# EAGLE design BUZZI-27 (EAGLE 4.15)
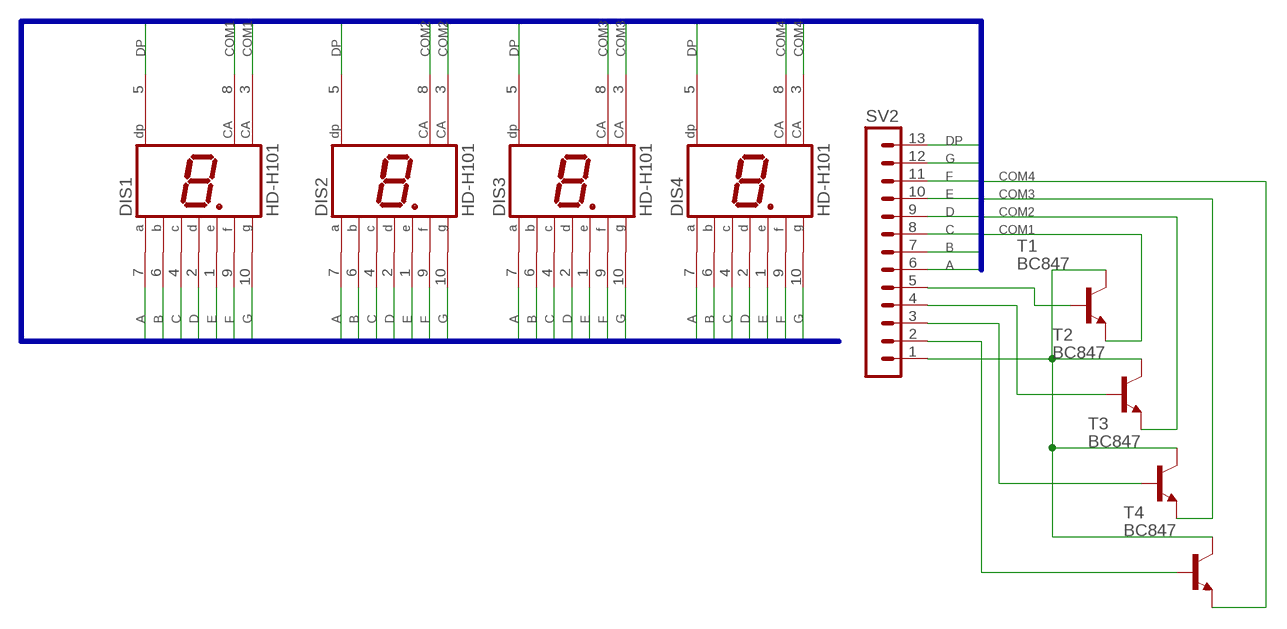
[diagram p0: schematic, sheet 1]

## Parts
DIS1  HD-H101  [HDSP-M]
DIS2  HD-H101  [HDSP-M]
DIS3  HD-H101  [HDSP-M]
DIS4  HD-H101  [HDSP-M]
SV2  MA13-1  [MA13-1]
T1  BC847  [SOT23]
T2  BC847  [SOT23]
T3  BC847  [SOT23]
T4  BC847  [SOT23]

## Nets
A: DIS1.7(A) DIS2.7(A) DIS3.7(A) DIS4.7(A) SV2.6
B: DIS1.6(B) DIS2.6(B) DIS3.6(B) DIS4.6(B) SV2.7
C: DIS1.4(C) DIS2.4(C) DIS3.4(C) DIS4.4(C) SV2.8
COM1: DIS1.3(CA) DIS1.8(CA) T1.2(E)
COM2: DIS2.3(CA) DIS2.8(CA) T2.2(E)
COM3: DIS3.3(CA) DIS3.8(CA) T3.2(E)
COM4: DIS4.3(CA) DIS4.8(CA) T4.2(E)
D: DIS1.2(D) DIS2.2(D) DIS3.2(D) DIS4.2(D) SV2.9
DP: DIS1.5(DP) DIS2.5(DP) DIS3.5(DP) DIS4.5(DP) SV2.13
E: DIS1.1(E) DIS2.1(E) DIS3.1(E) DIS4.1(E) SV2.10
F: DIS1.9(F) DIS2.9(F) DIS3.9(F) DIS4.9(F) SV2.11
G: DIS1.10(G) DIS2.10(G) DIS3.10(G) DIS4.10(G) SV2.12
N$1: SV2.5 T1.1(B)
N$2: SV2.4 T2.1(B)
N$3: SV2.3 T3.1(B)
N$4: SV2.2 T4.1(B)
N$5: SV2.1 T1.3(C) T2.3(C) T3.3(C) T4.3(C)

## Buses
DATA:A,B,C,D,E,F,G,DP,COM1,COM2,COM3,COM4

## Library data of the parts
DIS1-DIS4 = display-hp:HD-H101: LED DISPLAY 1-character 7 segment, decimal point right
SV2 = con-lstb:MA13-1: PIN HEADER
T1-T4 = transistor:BC847: NPN TRANSISTOR

## Board
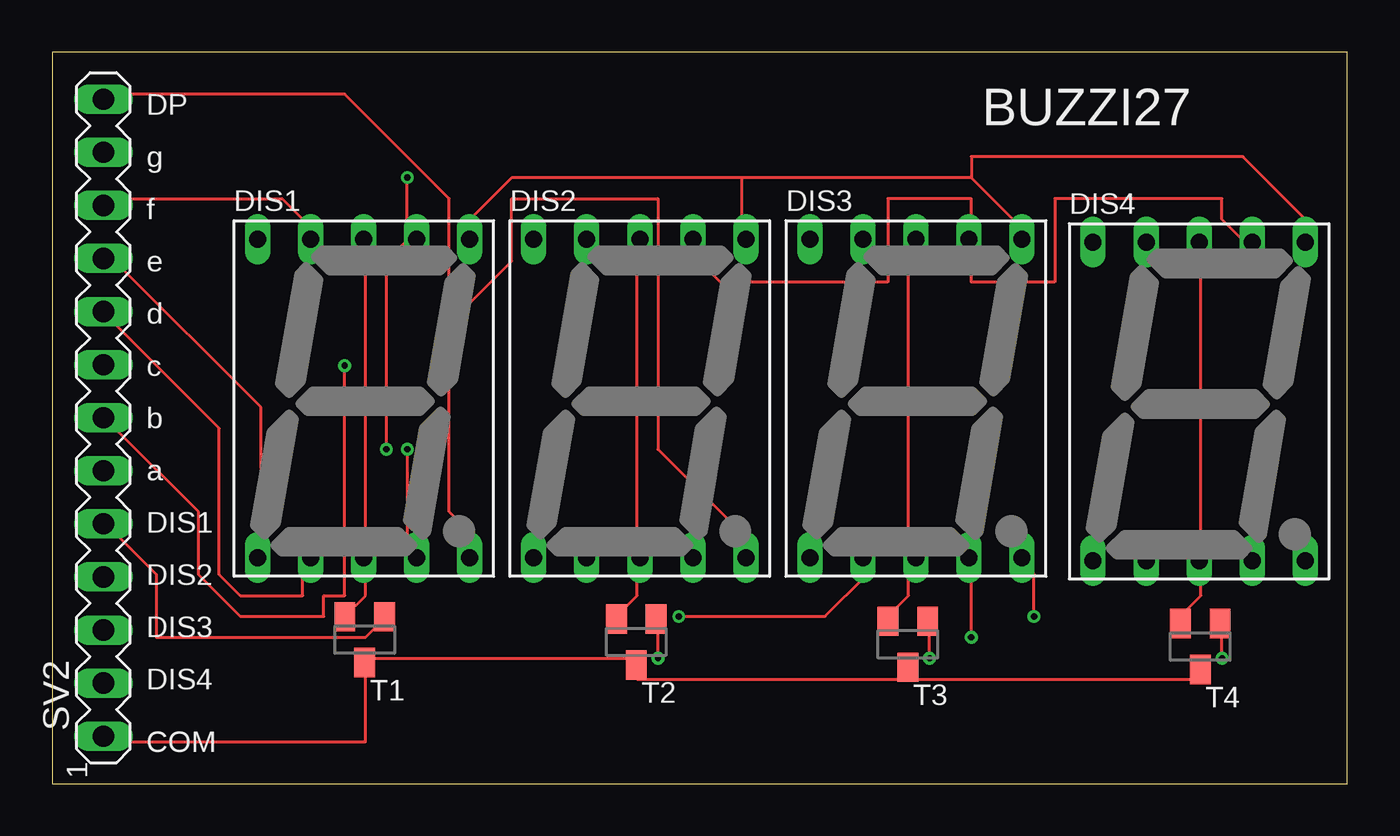
[diagram p1: board, top side]
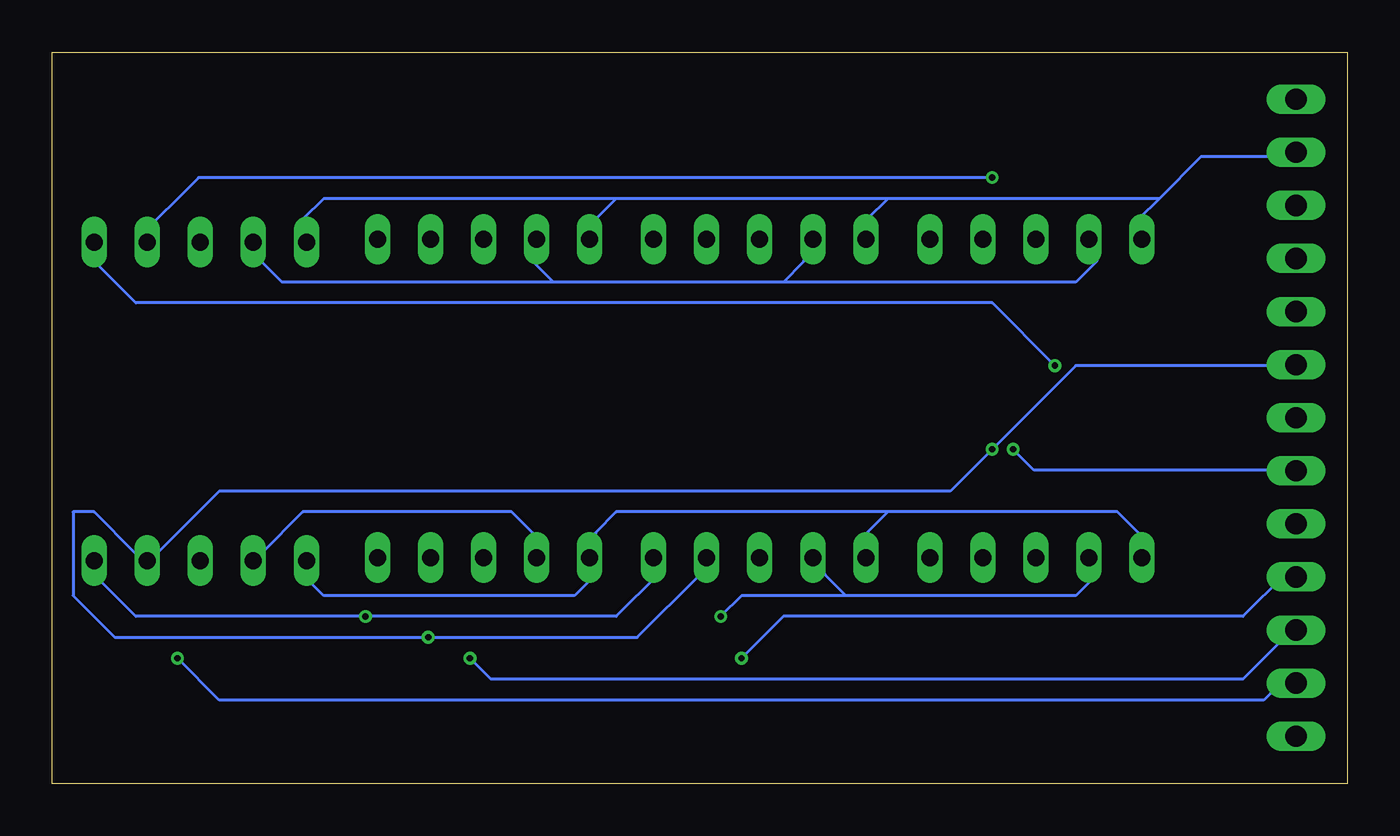
[diagram p2: board, bottom side, seen from below]

Size 62 x 35 mm. Coordinates in mm from the lower left corner, seen from the top.
Outline: 0,0 62,0 62,35 0,35 0,0
Copper layers (1*16): Top 0.035mm / dielectric 1.5mm / Bottom 0.035mm
Design rules "PCB-POOL": minimum track width 6mil, minimum drill 12mil, track to track 6mil, track to pad 6mil, pad to pad 6mil, via to via 6mil, smd to smd 6mil, copper to edge 20mil, drill to drill 8mil, minimum pad ring 8mil, minimum via ring 6mil, stop-mask expansion 3mil, vias tented up to drill 0mil, thermal gap 8mil

### Footprints (pad centres in the part's own frame; a part is rotated, then mirrored left to right if it is on the bottom)
HDSP-M = drill 0.813 long: 1 -5.08,-7.62; 2 -2.54,-7.62; 3 0,-7.62; 4 2.54,-7.62; 5 5.08,-7.62; 6 5.08,7.62; 7 2.54,7.62; 8 0,7.62; 9 -2.54,7.62; 10 -5.08,7.62
MA13-1 = drill 1.016 long: 1 -15.24,0; 2 -12.7,0; 3 -10.16,0; 4 -7.62,0; 5 -5.08,0; 6 -2.54,0; 7 0,0; 8 2.54,0; 9 5.08,0; 10 7.62,0; 11 10.16,0; 12 12.7,0; 13 15.24,0
SOT23 = smd 1 x 1.4: 1 -0.95,-1.1; 2 0.95,-1.1; 3 0,1.1

### Placement (x,y rotation side)
DIS1  14.91,18.43 0 top
DIS2  28.13,18.43 0 top
DIS3  41.35,18.43 0 top
DIS4  54.91,18.29 0 top
SV2  2.45,17.51 90 top
T1  14.96,6.89 180 top
T2  27.96,6.78 180 top
T3  40.96,6.67 180 top
T4  54.96,6.56 180 top

### Tracks (layer width: path | path; a pad name or v marks a point on that pad's centre or on a via)
A  (via drill 0.3)
  Top 0.152: v16,16 16,25 17,26 DIS1.7 17,27 v17,29 | DIS2.7 31,25 32,24 40,24 40,28 44,28 44,27 DIS3.7 44,25 44,24 48,24 48,28 56,28 56,27 57,26 DIS4.7
  Bottom 0.152: v16,16 15,15 3,15 SV2.6 | v17,29 55,29 58,26 DIS4.7
B  (via drill 0.3)
  Top 0.152: 33,29 22,29 20,27 DIS1.6 | 33,29 33,27 DIS2.6 | 44,29 46,27 DIS3.6 | 44,29 33,29 | 44,29 44,30 57,30 60,27 DIS4.6 | v14,20 14,9 13,9 13,8 9,8 7,10 7,13 3,17 SV2.7
  Bottom 0.152: v14,20 17,23 58,23 60,25 DIS4.6
C  (via drill 0.3)
  Top 0.152: v17,16 17,11 DIS1.4 | v44,7 44,10 DIS3.4
  Bottom 0.152: SV2.8 3,20 13,20 v17,16 19,14 54,14 57,11 DIS4.4 58,11 60,13 61,13 61,9 59,7 v44,7 34,7 31,10 DIS2.4
COM1
  Top 0.152: T1.2 15,9 15,10 DIS1.3 15,12 15,25 DIS1.8
COM2
  Top 0.152: T2.2 27,8 28,9 28,10 DIS2.3 28,12 28,25 DIS2.8
COM3
  Top 0.152: T3.2 40,8 41,9 41,10 DIS3.3 41,11 41,25 DIS3.8
COM4
  Top 0.152: T4.2 54,8 55,9 55,10 DIS4.3 55,11 55,25 DIS4.8
D  (via drill 0.3)
  Top 0.152: SV2.9 3,22 8,17 8,10 9,9 12,9 12,10 DIS1.2 | v30,8 37,8 39,10 DIS3.2
  Bottom 0.152: DIS4.2 52,11 50,13 40,13 39,12 DIS3.2 | 24,9 13,9 12,10 DIS1.2 | 24,9 25,10 DIS2.2 | v30,8 29,9 24,9
DP  (via drill 0.3)
  Top 0.152: v47,8 47,10 DIS3.5 | 19,22 19,28 14,33 3,33 SV2.13 | 19,22 19,13 20,12 DIS1.5 | 19,22 22,25 22,28 29,28 29,16 33,12 DIS2.5
  Bottom 0.152: DIS4.5 60,10 58,8 v47,8 35,8 33,10 DIS2.5
E
  Top 0.152: SV2.10 3,25 10,18 10,12 DIS1.1
  Bottom 0.152: 22,13 11,13 10,12 DIS1.1 | 22,13 23,12 DIS2.1 | 22,13 35,13 36,12 DIS3.1 36,10 37,9 49,9 50,10 DIS4.1
F
  Top 0.152: DIS1.9 12,27 11,28 3,28 SV2.11
  Bottom 0.152: 27,24 26,25 DIS2.9 | 27,24 38,24 | 38,24 39,25 DIS3.9 | 38,24 51,24 52,25 DIS4.9 | 27,24 13,24 12,25 DIS1.9
G
  Bottom 0.152: 9,28 7,30 3,30 SV2.12 | 9,28 10,27 DIS1.10 | 22,28 23,27 DIS2.10 | 9,28 22,28 | 35,28 36,27 DIS3.10 | 22,28 35,28 | 35,28 49,28 50,27 DIS4.10
N$1
  Top 0.152: T1.1 16,8 15,7 5,7 5,10 3,12 SV2.5
N$2  (via drill 0.3)
  Top 0.152: v29,6 29,8 T2.1
  Bottom 0.152: v29,6 27,8 5,8 3,10 SV2.4
N$3  (via drill 0.3)
  Top 0.152: v42,6 42,8 T3.1
  Bottom 0.152: v42,6 41,5 5,5 3,7 SV2.3
N$4  (via drill 0.3)
  Top 0.152: v56,6 56,7 T4.1
  Bottom 0.152: v56,6 54,4 4,4 3,5 SV2.2
N$5
  Top 0.152: 15,6 28,6 T2.3 28,5 41,5 | 41,5 55,5 T4.3 | 41,5 T3.3 | 15,6 15,2 3,2 SV2.1 | 15,6 T1.3

### Text on the board
tNames: DP | BUZZI27 | g | f | e | d | c | b | a | DIS1 | DIS2 | DIS3 | DIS4 | COM